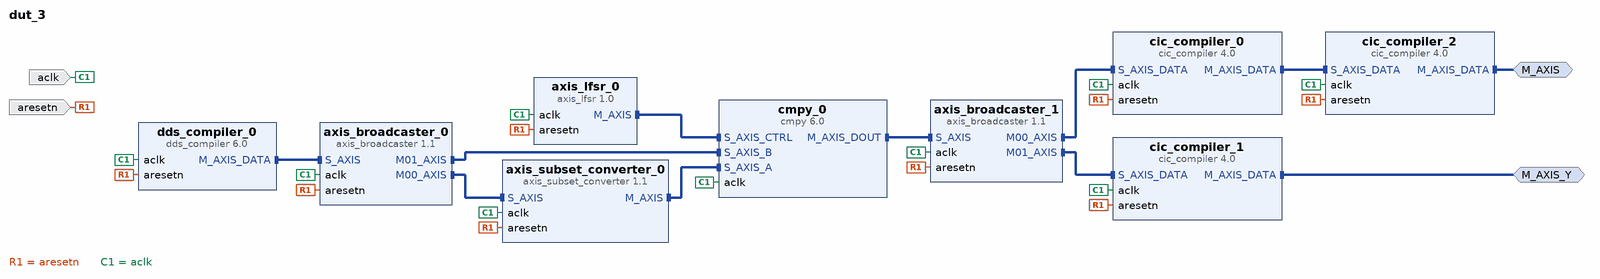
[diagram p0: block diagram of the top level]
# Vivado block design dut_3, Vivado 2015.4
create_bd_design dut_3

create_bd_intf_port -mode Master -vlnv xilinx.com:interface:axis_rtl:1.0 M_AXIS
set_property -dict {CONFIG.FREQ_HZ 125000000 CONFIG.CLK_DOMAIN DUT_aclk} [get_bd_intf_ports M_AXIS]
create_bd_intf_port -mode Master -vlnv xilinx.com:interface:axis_rtl:1.0 M_AXIS_Y
set_property -dict {CONFIG.FREQ_HZ 125000000 CONFIG.CLK_DOMAIN DUT_aclk} [get_bd_intf_ports M_AXIS_Y]
create_bd_port -dir I -type rst aresetn
create_bd_port -dir I -type clk aclk
set_property -dict {CONFIG.FREQ_HZ 125000000 CONFIG.CLK_DOMAIN DUT_aclk} [get_bd_ports aclk]

create_bd_cell -type ip -vlnv xilinx.com:ip:dds_compiler:6.0 dds_compiler_0
set_property -dict [list \
  CONFIG.DDS_Clock_Rate 125 \
  CONFIG.Parameter_Entry Hardware_Parameters \
  CONFIG.Noise_Shaping None \
  CONFIG.Phase_Width 32 \
  CONFIG.Output_Width 14 \
  CONFIG.Has_Phase_Out false \
  CONFIG.Has_TREADY true \
  CONFIG.M_DATA_Has_TUSER Not_Required \
  CONFIG.Latency 9 \
  CONFIG.Has_ARESETn true \
  CONFIG.Output_Frequency1 0 \
  CONFIG.PINC1 10000000000000000000000000 \
] [get_bd_cells dds_compiler_0]
create_bd_cell -type ip -vlnv xilinx.com:ip:axis_broadcaster:1.1 axis_broadcaster_0
set_property -dict [list \
  CONFIG.M_TDATA_NUM_BYTES 4 \
  CONFIG.S_TDATA_NUM_BYTES 4 \
  CONFIG.M00_TDATA_REMAP {tdata[31:0]} \
  CONFIG.M01_TDATA_REMAP {tdata[31:0]} \
] [get_bd_cells axis_broadcaster_0]
create_bd_cell -type ip -vlnv xilinx.com:ip:cmpy:6.0 cmpy_0
set_property -dict [list \
  CONFIG.APortWidth 14 \
  CONFIG.BPortWidth 14 \
  CONFIG.FlowControl Blocking \
  CONFIG.RoundMode Random_Rounding \
  CONFIG.OutputWidth 28 \
  CONFIG.MinimumLatency 9 \
] [get_bd_cells cmpy_0]
create_bd_cell -type ip -vlnv pavel-demin:user:axis_lfsr:1.0 axis_lfsr_0
create_bd_cell -type ip -vlnv xilinx.com:ip:axis_broadcaster:1.1 axis_broadcaster_1
set_property -dict [list \
  CONFIG.M_TDATA_NUM_BYTES 4 \
  CONFIG.S_TDATA_NUM_BYTES 8 \
  CONFIG.HAS_TREADY 1 \
  CONFIG.M00_TDATA_REMAP {tdata[31:0]} \
  CONFIG.M01_TDATA_REMAP {tdata[63:32]} \
] [get_bd_cells axis_broadcaster_1]
create_bd_cell -type ip -vlnv xilinx.com:ip:axis_subset_converter:1.1 axis_subset_converter_0
set_property -dict [list \
  CONFIG.S_TDATA_NUM_BYTES 4 \
  CONFIG.M_TDATA_NUM_BYTES 2 \
  CONFIG.S_HAS_TREADY 1 \
  CONFIG.M_HAS_TREADY 1 \
  CONFIG.TDATA_REMAP {tdata[15:0]} \
] [get_bd_cells axis_subset_converter_0]
create_bd_cell -type ip -vlnv xilinx.com:ip:cic_compiler:4.0 cic_compiler_0
set_property -dict [list \
  CONFIG.Filter_Type Decimation \
  CONFIG.Fixed_Or_Initial_Rate 8192 \
  CONFIG.Minimum_Rate 8192 \
  CONFIG.Maximum_Rate 8192 \
  CONFIG.Input_Sample_Frequency 125 \
  CONFIG.Clock_Frequency 125 \
  CONFIG.SamplePeriod 1 \
  CONFIG.Input_Data_Width 28 \
  CONFIG.Quantization Truncation \
  CONFIG.Output_Data_Width 32 \
  CONFIG.HAS_ARESETN true \
  CONFIG.HAS_DOUT_TREADY false \
] [get_bd_cells cic_compiler_0]
create_bd_cell -type ip -vlnv xilinx.com:ip:cic_compiler:4.0 cic_compiler_1
set_property -dict [list \
  CONFIG.Filter_Type Decimation \
  CONFIG.Fixed_Or_Initial_Rate 8192 \
  CONFIG.Minimum_Rate 8192 \
  CONFIG.Maximum_Rate 8192 \
  CONFIG.Input_Sample_Frequency 125 \
  CONFIG.Clock_Frequency 125 \
  CONFIG.SamplePeriod 1 \
  CONFIG.Input_Data_Width 28 \
  CONFIG.Quantization Truncation \
  CONFIG.Output_Data_Width 32 \
  CONFIG.HAS_ARESETN true \
  CONFIG.HAS_DOUT_TREADY false \
] [get_bd_cells cic_compiler_1]
create_bd_cell -type ip -vlnv xilinx.com:ip:cic_compiler:4.0 cic_compiler_2
set_property -dict [list \
  CONFIG.Filter_Type Decimation \
  CONFIG.Fixed_Or_Initial_Rate 128 \
  CONFIG.Minimum_Rate 128 \
  CONFIG.Maximum_Rate 128 \
  CONFIG.Input_Sample_Frequency 125 \
  CONFIG.Clock_Frequency 125 \
  CONFIG.SamplePeriod 1 \
  CONFIG.Input_Data_Width 32 \
  CONFIG.Quantization Truncation \
  CONFIG.Output_Data_Width 32 \
  CONFIG.HAS_ARESETN true \
] [get_bd_cells cic_compiler_2]

# ---- connections ----

connect_bd_intf_net [get_bd_intf_pins axis_broadcaster_0/S_AXIS] [get_bd_intf_pins dds_compiler_0/M_AXIS_DATA]
connect_bd_intf_net [get_bd_intf_pins cmpy_0/S_AXIS_B] [get_bd_intf_pins axis_broadcaster_0/M01_AXIS]
connect_bd_intf_net [get_bd_intf_pins axis_lfsr_0/M_AXIS] [get_bd_intf_pins cmpy_0/S_AXIS_CTRL]
connect_bd_intf_net [get_bd_intf_pins axis_broadcaster_1/S_AXIS] [get_bd_intf_pins cmpy_0/M_AXIS_DOUT]
connect_bd_intf_net [get_bd_intf_pins axis_subset_converter_0/S_AXIS] [get_bd_intf_pins axis_broadcaster_0/M00_AXIS]
connect_bd_intf_net [get_bd_intf_pins axis_subset_converter_0/M_AXIS] [get_bd_intf_pins cmpy_0/S_AXIS_A]
connect_bd_intf_net [get_bd_intf_pins cic_compiler_0/S_AXIS_DATA] [get_bd_intf_pins axis_broadcaster_1/M00_AXIS]
connect_bd_intf_net [get_bd_intf_pins cic_compiler_1/S_AXIS_DATA] [get_bd_intf_pins axis_broadcaster_1/M01_AXIS]
connect_bd_intf_net [get_bd_intf_pins cic_compiler_2/S_AXIS_DATA] [get_bd_intf_pins cic_compiler_0/M_AXIS_DATA]
connect_bd_intf_net [get_bd_intf_ports M_AXIS] [get_bd_intf_pins cic_compiler_2/M_AXIS_DATA]
connect_bd_intf_net [get_bd_intf_ports M_AXIS_Y] [get_bd_intf_pins cic_compiler_1/M_AXIS_DATA]
connect_bd_net [get_bd_ports aresetn] \
  [get_bd_pins dds_compiler_0/aresetn] [get_bd_pins axis_broadcaster_0/aresetn] [get_bd_pins axis_lfsr_0/aresetn] \
  [get_bd_pins axis_broadcaster_1/aresetn] [get_bd_pins axis_subset_converter_0/aresetn] [get_bd_pins cic_compiler_1/aresetn] \
  [get_bd_pins cic_compiler_0/aresetn] [get_bd_pins cic_compiler_2/aresetn]
connect_bd_net [get_bd_ports aclk] \
  [get_bd_pins dds_compiler_0/aclk] [get_bd_pins axis_broadcaster_0/aclk] [get_bd_pins axis_lfsr_0/aclk] \
  [get_bd_pins cmpy_0/aclk] [get_bd_pins axis_broadcaster_1/aclk] [get_bd_pins axis_subset_converter_0/aclk] \
  [get_bd_pins cic_compiler_0/aclk] [get_bd_pins cic_compiler_1/aclk] [get_bd_pins cic_compiler_2/aclk]

validate_bd_design
save_bd_design
